# Altium schematic sheet IIC_Sensor.SchDoc
size A4
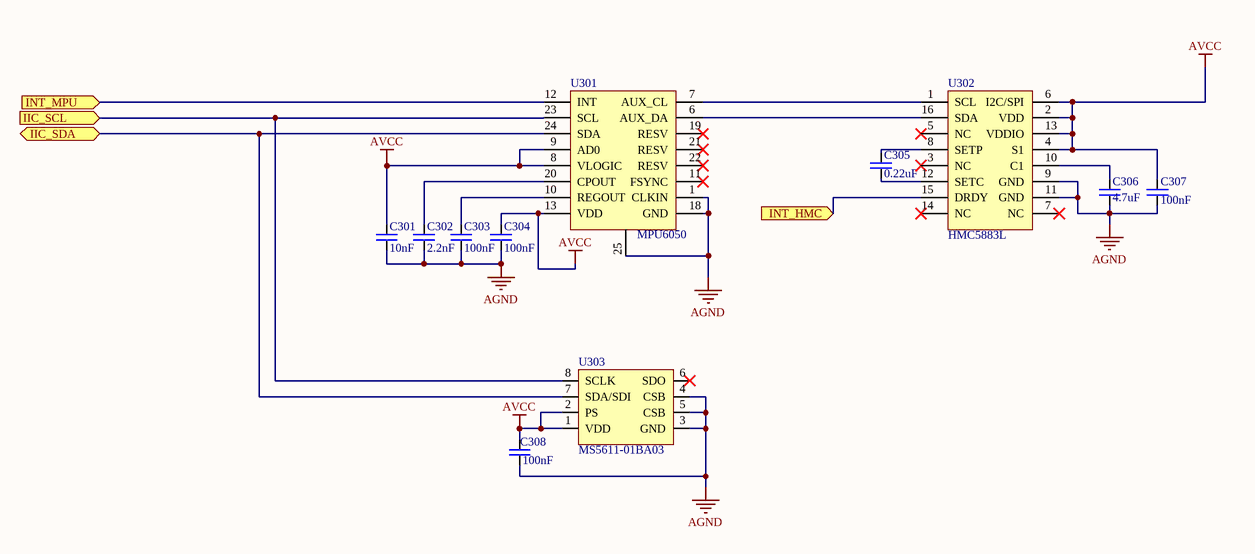
[diagram p0: IIC_Sensor.SchDoc]

## Parts
C301  10nF  [0603]
C302  2.2nF  [0603]
C303  100nF  [0603]
C304  100nF  [0603]
C305  0.22uF  [0603]
C306  4.7uF  [0603]
C307  100nF  [0603]
C308  100nF  [0603]
U301  MPU6050  [MPU6050]
U302  HMC5883L  [HMC5883L]
U303  MS5611-01BA03  [MS5611-01BA03]

## Ports
IIC_SCL (in), IIC_SDA (bidir), INT_HMC (in), INT_MPU (in)

## Nets
AGND: C301.1 C302.1 C303.1 C304.1 C306.1 C307.1 C308.1 U301.1(CLKIN) U301.18(GND) U301.25 U302.9(GND) U302.11(GND) U303.3(GND) U303.4(CSB) U303.5(CSB)
AVCC: C301.2 C304.2 C307.2 C308.2 U301.8(VLOGIC) U301.9(AD0) U301.13(VDD) U302.2(VDD) U302.4(S1) U302.6(I2C/SPI) U302.13(VDDIO) U303.1(VDD) U303.2(PS)
IIC_SCL: U301.23(SCL) U303.8(SCLK) ; port IIC_SCL
IIC_SDA: U301.24(SDA) U303.7(SDA/SDI) ; port IIC_SDA
INT_HMC: U302.15(DRDY) ; port INT_HMC
INT_MPU: U301.12(INT) ; port INT_MPU
NetC302_2: C302.2 U301.20(CPOUT)
NetC303_2: C303.2 U301.10(REGOUT)
NetC305_1: C305.1 U302.12(SETC)
NetC305_2: C305.2 U302.8(SETP)
NetC306_2: C306.2 U302.10(C1)
NetU301_6: U301.6(AUX_DA) U302.16(SDA)
NetU301_7: U301.7(AUX_CL) U302.1(SCL)

Not connected (* = marked no-connect by the designer): U301 11(FSYNC)* 19(RESV)* 21(RESV)* 22(RESV)*; U302 3(NC)* 5(NC)* 7(NC)* 14(NC)*; U303 6(SDO)*

## Library data of the parts
C301-C308 = C0603